# EAGLE design expansion_board (EAGLE 6.5.0)
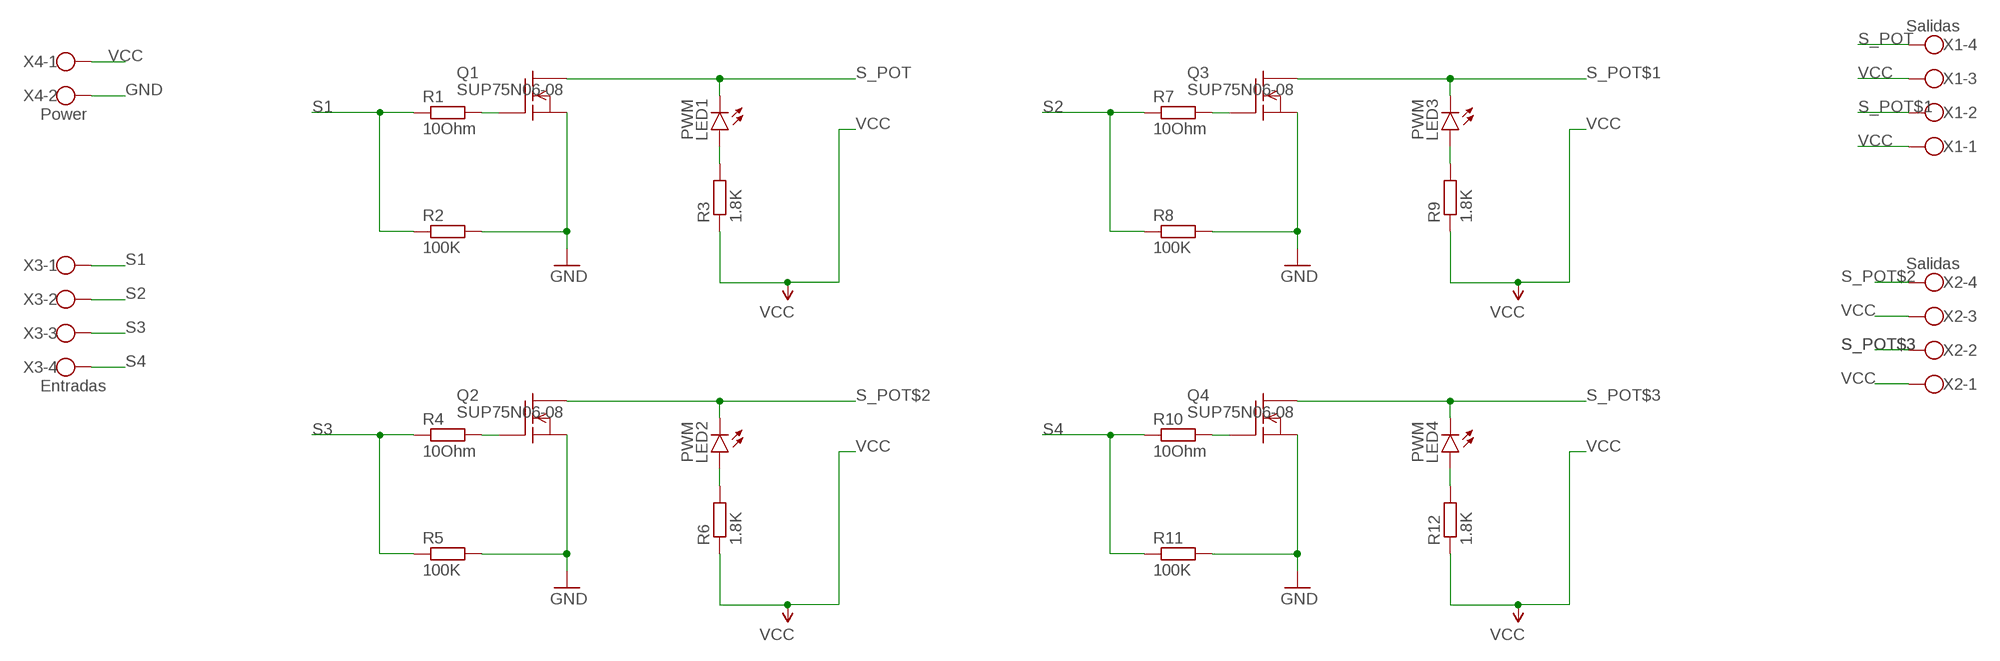
[diagram p0: schematic, sheet 1]

## Parts
LED1  PWM  LED5MM  [LED5MM]
LED2  PWM  LED5MM  [LED5MM]
LED3  PWM  LED5MM  [LED5MM]
LED4  PWM  LED5MM  [LED5MM]
Q1  SUP75N06-08  [TO220]
Q2  SUP75N06-08  [TO220]
Q3  SUP75N06-08  [TO220]
Q4  SUP75N06-08  [TO220]
R1  10Ohm  R-EU_0207/7  [0207/7]
R2  100K  R-EU_0207/7  [0207/7]
R3  1.8K  R-EU_0207/7  [0207/7]
R4  10Ohm  R-EU_0207/7  [0207/7]
R5  100K  R-EU_0207/7  [0207/7]
R6  1.8K  R-EU_0207/7  [0207/7]
R7  10Ohm  R-EU_0207/7  [0207/7]
R8  100K  R-EU_0207/7  [0207/7]
R9  1.8K  R-EU_0207/7  [0207/7]
R10  10Ohm  R-EU_0207/7  [0207/7]
R11  100K  R-EU_0207/7  [0207/7]
R12  1.8K  R-EU_0207/7  [0207/7]
X1  Salidas  W237-4  [W237-4]
X2  Salidas  W237-4  [W237-4]
X3  Entradas  W237-4  [W237-4]
X4  Power  W237-102  [W237-102]

## Nets
GND: Q1.3(S) Q2.3(S) Q3.3(S) Q4.3(S) R2.2 R5.2 R8.2 R11.2 X4.2
N$1: Q3.1(G) R7.2
N$2: Q1.1(G) R1.2
N$3: Q2.1(G) R4.2
N$4: LED1.A R3.2
N$5: LED2.A R6.2
N$6: LED3.A R9.2
N$7: Q4.1(G) R10.2
N$8: LED4.A R12.2
S1: R1.1 R2.1 X3.1
S2: R7.1 R8.1 X3.2
S3: R4.1 R5.1 X3.3
S4: R10.1 R11.1 X3.4
S_POT: LED1.K(C) Q1.2(D) X1.4
S_POT$1: LED3.K(C) Q3.2(D) X1.2
S_POT$2: LED2.K(C) Q2.2(D) X2.4
S_POT$3: LED4.K(C) Q4.2(D) X2.2
VCC: R3.1 R6.1 R9.1 R12.1 X1.1 X1.3 X2.1 X2.3 X4.1

## Library data of the parts
LED1-LED4 = SparkFun-LED:LED: LEDs Standard schematic elements and footprints for 5mm, 3mm, 1206, and 0603 sized LEDs. 5mm - Spark Fun Electronics SKU : COM-00529 (and others)
Q1-Q4 = transistor-fet:SUP75N06-08: N-Channel Enhancement MOSFET 60V; 75A; 0,008Ohm
R1-R12 = resistor:R-EU_: RESISTOR, European symbol
X1-X3 = con-wago-500:W237-4: WAGO SCREW CLAMP; OC_FARNELL: unknown; OC_NEWARK: unknown
X4 = con-wago-500:W237-102: WAGO SCREW CLAMP; MPN: 237-102; OC_FARNELL: unknown; OC_NEWARK: 70K9898

## Board
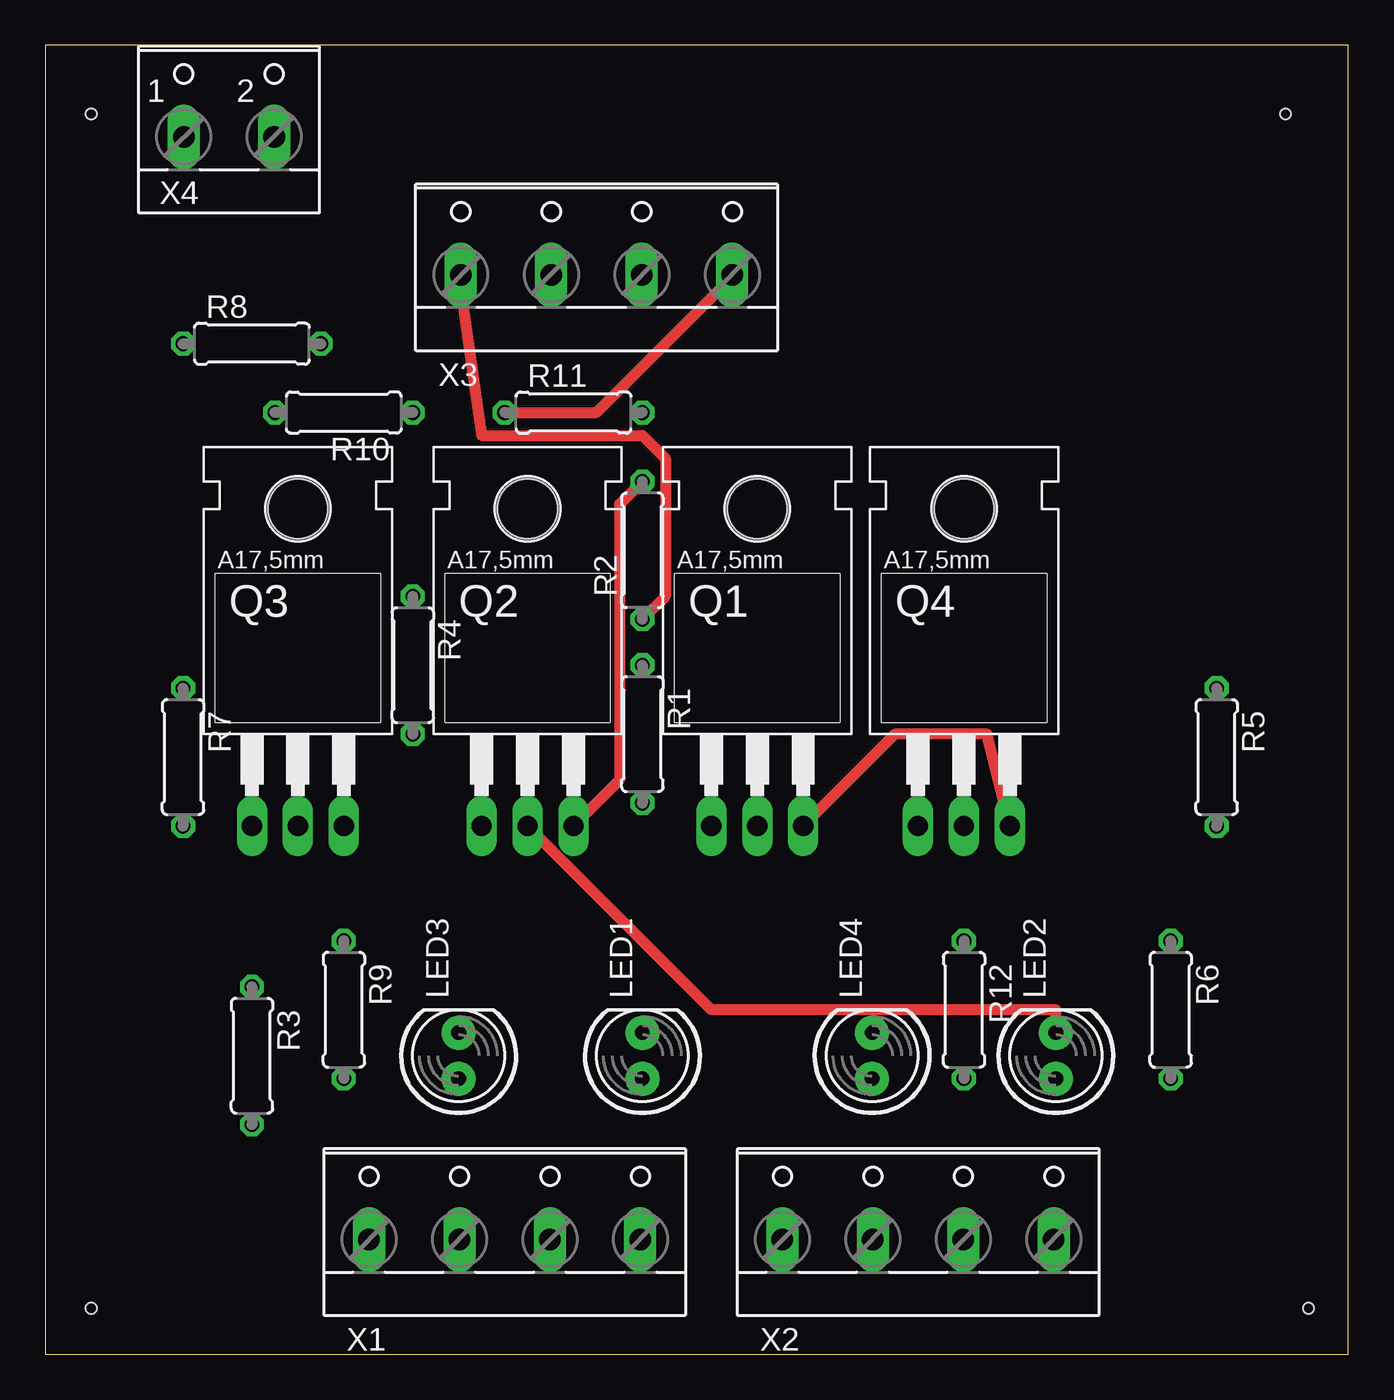
[diagram p1: board, top side]
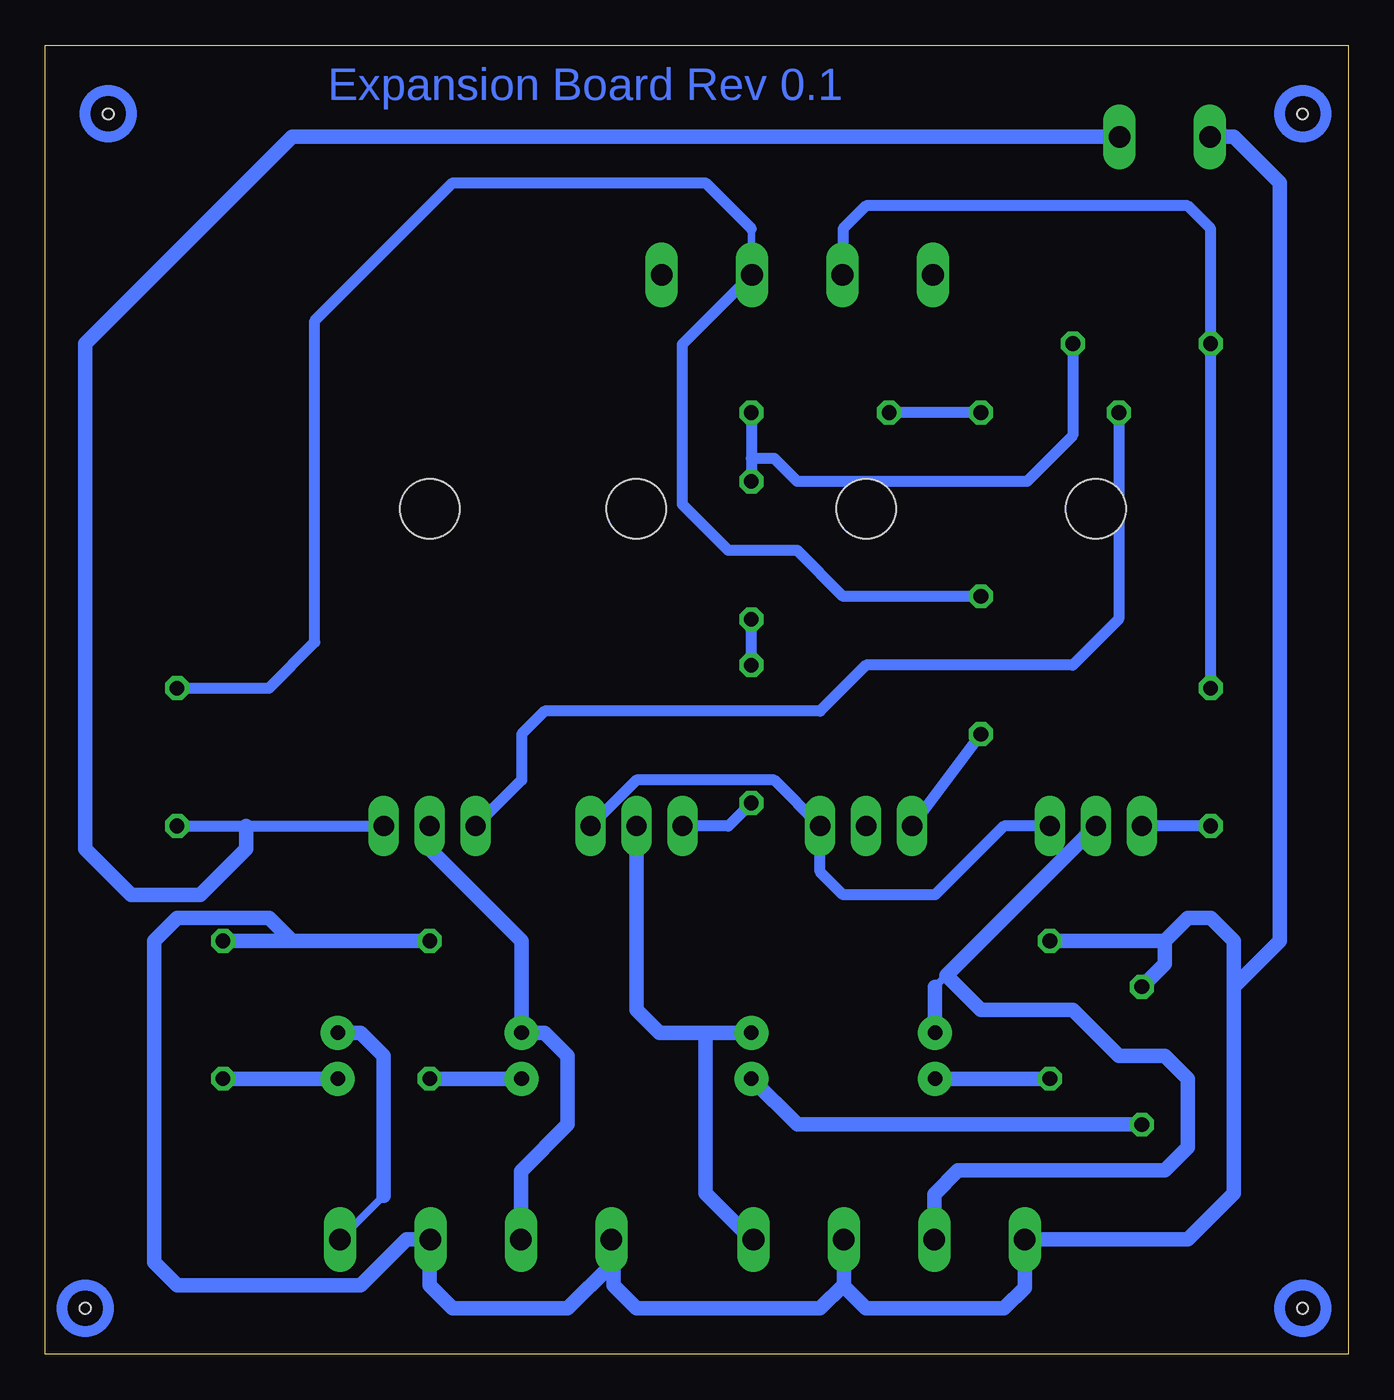
[diagram p2: board, bottom side, seen from below]

Size 72.06 x 72.38 mm. Coordinates in mm from the lower left corner, seen from the top.
Outline: 0,0 72.06,0 72.06,72.38 0,72.38 0,0
Copper layers (1*16): Top 0.035mm / dielectric 1.5mm / Bottom 0.035mm
Design rules "default": minimum track width 10mil, minimum drill 24mil, track to track 8mil, track to pad 8mil, pad to pad 8mil, via to via 8mil, smd to smd 8mil, copper to edge 40mil, drill to drill 8mil, minimum pad ring 10mil, minimum via ring 8mil, stop-mask expansion 4mil, vias tented up to drill 0mil, thermal gap 10mil
Holes 0.6 mm at 68.58,68.58 69.85,2.54 2.54,2.54 2.54,68.58

### Footprints (pad centres in the part's own frame; a part is rotated, then mirrored left to right if it is on the bottom)
LED5MM = drill 0.813 pad 1.88: A -1.27,0; K 1.27,0
TO220 = drill 1.118 long: 1 -2.54,-6.35; 2 0,-6.35; 3 2.54,-6.35 | hole 3.302: 0,11.176
0207/7 = drill 0.813 octagon: 1 -3.81,0; 2 3.81,0
W237-4 = drill 1.194 long: 1 -7.5,-1.27; 2 -2.5,-1.27; 3 2.5,-1.27; 4 7.5,-1.27
W237-102 = drill 1.194 long: 1 -2.5,-1.27; 2 2.5,-1.27

### Placement (x,y rotation side)
LED1  33.02,16.51 90 top
LED2  55.88,16.51 90 top
LED3  22.86,16.51 90 top
LED4  45.72,16.51 90 top
Q1  39.37,35.56 0 top
Q2  26.67,35.56 0 top
Q3  13.97,35.56 0 top
Q4  50.8,35.56 0 top
R1  33.02,34.29 270 top
R2  33.02,44.45 90 top
R3  11.43,16.51 270 top
R4  20.32,38.1 270 top
R5  64.77,33.02 270 top
R6  62.23,19.05 270 top
R7  7.62,33.02 270 top
R8  11.43,55.88 0 top
R9  16.51,19.05 270 top
R10  16.51,52.07 180 top
R11  29.21,52.07 0 top
R12  50.8,19.05 270 top
X1  25.4,7.62 0 top
X2  48.26,7.62 0 top
X3  30.48,60.96 0 top
X4  10.16,68.58 0 top

### Tracks (layer width: path | path; a pad name or v marks a point on that pad's centre or on a via)
GND
  Top 0.61: Q1.3 46.99,34.29 52.07,34.29 Q4.3 | Q2.3 31.75,31.75 31.75,46.99 R2.2
  Bottom 0.61: R11.2 33.02,49.53 | 33.02,49.53 R2.2 | R8.2 15.24,50.8 17.78,48.26 30.48,48.26 31.75,49.53 33.02,49.53 | R5.2 60.96,29.21 Q4.3 | Q3.3 19.05,29.21 22.86,25.4 27.94,25.4 29.21,26.67 Q2.3 31.75,31.75 39.37,31.75 Q1.3
  Bottom 0.813: X4.2 58.42,67.31 69.85,55.88 69.85,27.94 67.31,25.4 63.5,25.4 60.96,27.94 60.96,29.21
N$1
  Bottom 0.61: R7.2 Q3.1
N$2
  Bottom 0.61: R1.2 34.29,29.21 Q1.1
N$3
  Bottom 0.61: R4.2 Q2.1
N$4
  Bottom 0.813: R3.2 30.48,12.7 LED1.A
N$5
  Bottom 0.813: LED2.A R6.2
N$6
  Bottom 0.813: R9.2 LED3.A
N$7
  Bottom 0.61: R10.2 12.7,40.64 15.24,38.1 26.67,38.1 29.21,35.56 44.45,35.56 45.72,34.29 45.72,31.75 Q4.1
N$8
  Bottom 0.813: R12.2 LED4.A
S1
  Top 0.254: 22.86,59.69 X3.1
  Top 0.61: R2.1 34.29,41.91 34.29,49.53 33.02,50.8 24.13,50.8 22.86,59.69
  Bottom 0.61: R1.1 R2.1
S2
  Bottom 0.406: 27.94,59.73 X3.2
  Bottom 0.61: R7.1 R8.1 7.62,62.23 8.89,63.5 26.67,63.5 27.94,62.23 27.94,59.73
S3
  Bottom 0.406: 33.02,62.23 33.02,59.73 X3.3
  Bottom 0.61: R5.1 59.69,36.83 57.15,39.37 57.15,57.15 49.53,64.77 35.56,64.77 33.02,62.23 | R4.1 27.94,41.91 30.48,44.45 34.29,44.45 36.83,46.99 36.83,55.84 X3.3
S4
  Top 0.254: 38.1,59.69 X3.4
  Top 0.61: 38.1,59.69 30.48,52.07 R11.1
  Bottom 0.61: R10.1 R11.1
S_POT
  Bottom 0.406: X1.4 33.02,6.35
  Bottom 0.813: LED1.K 35.56,17.78 | 35.56,17.78 38.1,17.78 39.37,19.05 Q1.2 | 33.02,6.35 35.56,8.89 35.56,17.78
S_POT$1
  Bottom 0.406: 22.86,20.32 22.23,20.95
  Bottom 0.813: LED3.K 22.86,20.32 | Q3.2 22.23,20.95 20.32,19.05 15.24,19.05 12.7,16.51 10.16,16.51 8.89,15.24 8.89,11.43 10.16,10.16 21.59,10.16 22.9,8.85 X1.2
S_POT$2
  Top 0.61: Q2.2 36.83,19.05 55.88,19.05 LED2.K
  Bottom 0.406: 53.34,8.77 X2.4
  Bottom 0.813: LED2.K 54.61,17.78 53.34,16.51 53.34,8.77
S_POT$3
  Bottom 0.813: Q4.2 50.8,27.94 45.72,22.86 LED4.K 44.45,17.78 43.18,16.51 43.18,12.7 45.76,10.12 X2.2
VCC
  Bottom 0.406: 27.94,3.81 27.94,6.31 X1.3 | 40.64,6.23 X2.1 | 50.8,6.31 X2.3
  Bottom 0.813: R12.1 58.42,22.86 | 58.42,22.86 R6.1 | X2.3 52.07,6.35 54.61,3.81 64.77,3.81 66.04,5.08 66.04,22.86 64.77,24.13 59.69,24.13 58.42,22.86 | R3.1 10.16,21.59 10.16,22.86 | R9.1 10.16,22.86 | 10.16,22.86 8.89,24.13 7.62,24.13 6.35,22.86 6.35,20.32 | 6.35,20.32 6.35,8.89 8.89,6.35 X1.1 17.9,3.69 19.05,2.54 26.67,2.54 27.94,3.81 | X1.3 27.9,3.85 29.21,2.54 39.37,2.54 40.64,3.81 40.64,6.23 | X2.1 40.76,4.96 43.18,2.54 49.53,2.54 50.8,3.81 50.8,6.31 | X4.1 6.35,67.31 3.81,64.77 3.81,22.86 6.35,20.32
(copper drawn outside any net)
  shapes: Bottom circle x4

### Text on the board
Bottom: Expansion Board Rev 0.1